# EAGLE schematic line_follower (EAGLE 9.6.2)
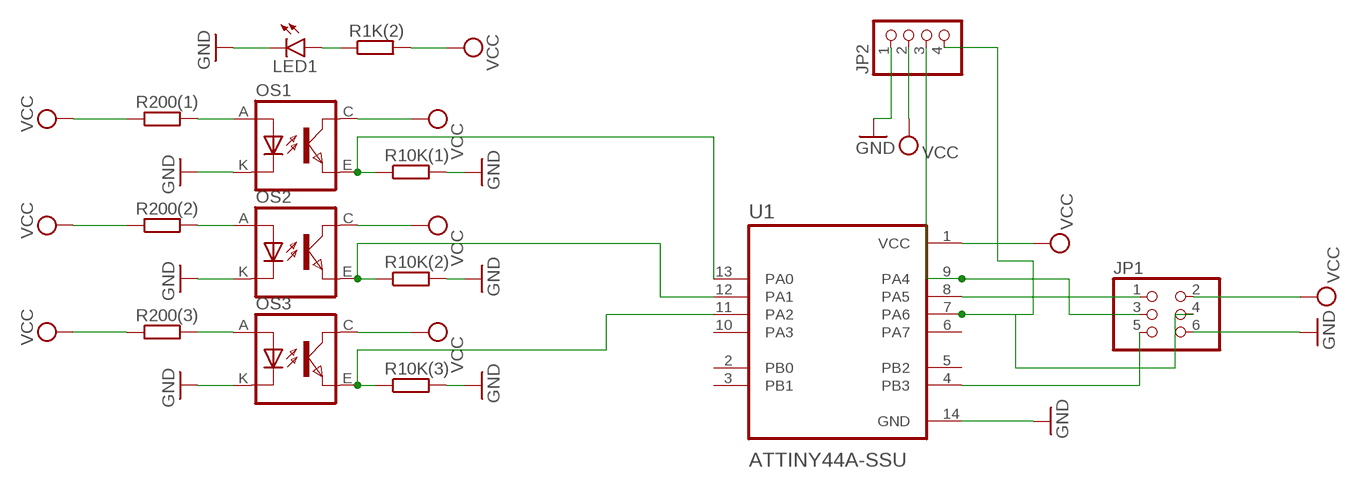
[diagram p0: schematic, sheet 1]

## Parts
JP1  PINHD-2X03_2.54-SMD  [2X03SMD]
JP2  PINHD-1X04_2.54-SMD  [1X04SMD]
LED1  LEDCHIPLED_1206  [CHIPLED_1206]
OS1  TCRT5000  [TCRT5000]
OS2  TCRT5000  [TCRT5000]
OS3  TCRT5000  [TCRT5000]
R1K(2)  R-EU_R1206  [R1206]
R10K(1)  R-EU_R1206  [R1206]
R10K(2)  R-EU_R1206  [R1206]
R10K(3)  R-EU_R1206  [R1206]
R200(1)  R-EU_R1206  [R1206]
R200(2)  R-EU_R1206  [R1206]
R200(3)  R-EU_R1206  [R1206]
U1  ATTINY44A-SSU  [SOIC127P600X175-14N]

## Nets
GND: JP1.6 JP2.1 LED1.C OS1.K(CATHODE) OS2.K(CATHODE) OS3.K(CATHODE) R10K(1).2 R10K(2).2 R10K(3).2 U1.14(GND)
N$1: OS1.E(EMITTER) R10K(1).1 U1.13(PA0)
N$3: LED1.A R1K(2).1
N$4: JP1.4 JP2.4 U1.7(PA6)
N$5: OS2.E(EMITTER) R10K(2).1 U1.12(PA1)
N$6: JP1.1 U1.8(PA5)
N$7: OS3.E(EMITTER) R10K(3).1 U1.11(PA2)
N$9: JP1.5 U1.4(PB3)
N$10: OS1.A(ANODE) R200(1).2
N$11: JP1.3 JP2.3 U1.9(PA4)
N$17: OS2.A(ANODE) R200(2).2
N$19: OS3.A(ANODE) R200(3).2
VCC: JP1.2 JP2.2 OS1.C(COLLECTOR) OS2.C(COLLECTOR) OS3.C(COLLECTOR) R1K(2).2 R200(1).1 R200(2).1 R200(3).1 U1.1(VCC)
Unconnected: U1.2(PB0) U1.3(PB1) U1.5(PB2) U1.6(PA7) U1.10(PA3)

## Library data of the parts
JP1 = pinhead-2:PINHD-2X03: PIN HEADER
JP2 = pinhead-2:PINHD-1X04: PIN HEADER
LED1 = led:LED: LED OSRAM: - CHIPLED LG R971, LG N971, LY N971, LG Q971, LY Q971, LO R971, LY R971 LH N974, LH R974 LS Q976, LO Q976, LY Q976 LO Q996 - Hyper CHIPLED LW Q18S LB Q993, LB Q99A, LB R99A - SideLED LS A670, LO A670, LY A670, LG A670, LP A670 LB A673, LV A673, LT A673, LW A673 LH A674 LY A675 LS A676, LA A676, LO A676, LY A676, LW A676 LS A679, LY A679, LG A679 - Hyper Micro SIDELED® LS Y876, LA Y876, LO Y876, LY Y876 LT Y87S - SmartLED LW L88C, LW L88S LB L89C, LB L89S, LG L890 LS L89K, LO L89K, LY L89K LS L896, LA L896, LO L896, LY L896 - TOPLED LS T670, LO T670, LY T670, LG T670, LP T670 LSG T670, LSP T670, LSY T670, LOP T670, LYG T670 LG T671, LOG T671, LSG T671 LB T673, LV T673, LT T673, LW T673 LH T674 LS T676, LA T676, LO T676, LY T676, LB T676, LH T676, LSB T676, LW T676 LB T67C, LV T67C, LT T67C, LS T67K, LO T67K, LY T67K, LW E67C LS E67B, LA E67B, LO E67B, LY E67B, LB E67C, LV E67C, LT E67C LW T67C LS T679, LY T679, LG T679 LS T770, LO T770, LY T770, LG T770, LP T770 LB T773, LV T773, LT T773, LW T773 LH T774 LS E675, LA E675, LY E675, LS T675 LS T776, LA T776, LO T776, LY T776, LB T776 LHGB T686 LT T68C, LB T68C - Hyper Mini TOPLED® LB M676 - Mini TOPLED Santana® LG M470 LS M47K, LO M47K, LY M47K Source: http://www.osram.convergy.de LUXEON: - LUMILED® LXK2-PW12-R00, LXK2-PW12-S00, LXK2-PW14-U00, LXK2-PW14-V00 LXK2-PM12-R00, LXK2-PM12-S00, LXK2-PM14-U00 LXK2-PE12-Q00, LXK2-PE12-R00, LXK2-PE12-S00, LXK2-PE14-T00, LXK2-PE14-U00 LXK2-PB12-K00, LXK2-PB12-L00, LXK2-PB12-M00, LXK2-PB14-N00, LXK2-PB14-P00, LXK2-PB14-Q00 LXK2-PR12-L00, LXK2-PR12-M00, LXK2-PR14-Q00, LXK2-PR14-R00 LXK2-PD12-Q00, LXK2-PD12-R00, LXK2-PD12-S00 LXK2-PH12-R00, LXK2-PH12-S00 LXK2-PL12-P00, LXK2-PL12-Q00, LXK2-PL12-R00 Source: www.luxeon.com KINGBRIGHT: KA-3528ASYC Source: www.kingbright.com
OS1-OS3 = tcrt5000:TCRT5000
R1K(2) R10K(1) R10K(2) R10K(3) R200(1) R200(2) R200(3) = rcl:R-EU_: RESISTOR, European symbol; SPICEPREFIX: R
U1 = ATTINY44A-SSU:ATTINY44A-SSU; AVAILABILITY: Unavailable; DESCRIPTION: AVR AVR® ATtiny Microcontroller IC 8-Bit 20MHz 4KB _2K x 16_ FLASH 14-SOIC; MF: Microchip; MP: ATTINY44A-SSU; PACKAGE: SOIC-14 Microchip; PRICE: None